# EAGLE schematic Motor_Driver2 (EAGLE 7.7.0)
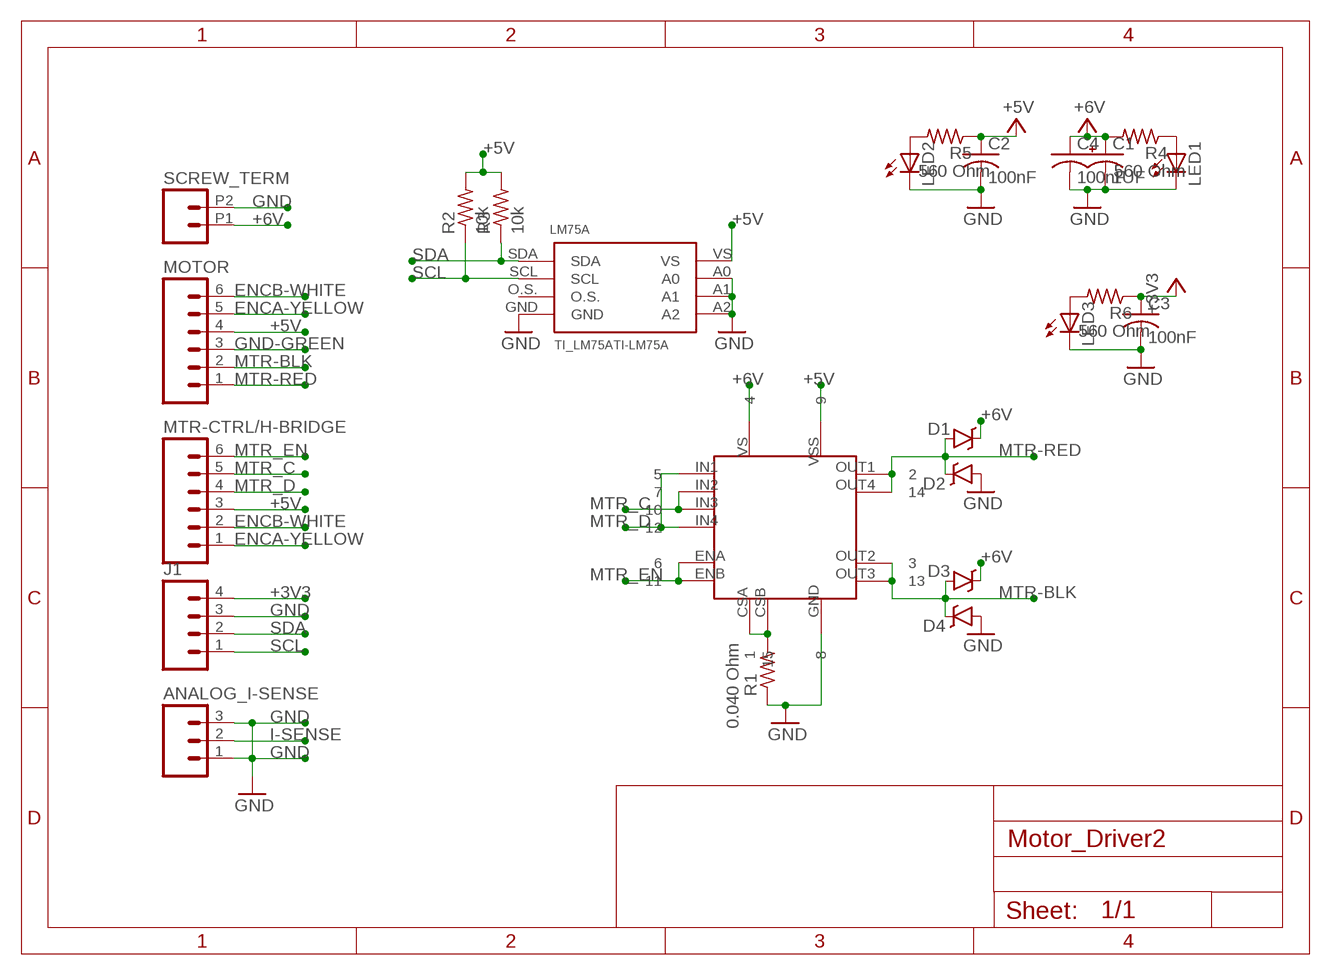
[diagram p0: schematic, sheet 1]

## Parts
ANALOG_I-SENSE  M03PTH  [1X03]
C1  1UF  1UF-50V-20%(PTH)KIT  [CPOL-RADIAL-1UF-50V-KIT]
C2  100nF  C-USC1206  [C1206]
C3  100nF  C-USC1206  [C1206]
C4  100nF  C-USC1206  [C1206]
D1  B340A  DIODE-SCHOTTKY-B340A  [SMA-DIODE]
D2  B340A  DIODE-SCHOTTKY-B340A  [SMA-DIODE]
D3  B340A  DIODE-SCHOTTKY-B340A  [SMA-DIODE]
D4  B340A  DIODE-SCHOTTKY-B340A  [SMA-DIODE]
J1  M04PTH  [1X04]
LED1  LEDSMT1206  [1206]
LED2  LEDSMT1206  [1206]
LED3  LEDSMT1206  [1206]
LM75A  TI_LM75ATI-LM75A  [TI_LM75A]
MOTOR  M06SILK_FEMALE_PTH  [1X06]
MTR-CTRL/H-BRIDGE  M06SILK_FEMALE_PTH  [1X06]
R1  0.040 Ohm  R-US_M0805  [M0805]
R2  10k  R-US_M1206  [M1206]
R3  10k  R-US_M1206  [M1206]
R4  560 Ohm  R-US_M0805  [M0805]
R5  560 Ohm  R-US_M0805  [M0805]
R6  560 Ohm  R-US_M0805  [M0805]
SCREW_TERM  M022.54MM_SCREWTERM  [1X02_2.54_SCREWTERM]
U$1  STL298N  [STL298N]

## Nets
+3V3: C3.1 J1.4 R6.1
+5V: C2.1 LM75A.VS MOTOR.4 MTR-CTRL/H-BRIDGE.3 R2.2 R3.2 R5.1
+6V: C1.1(+) C4.1 D1.C D3.C R4.2 SCREW_TERM.P1
ENCA-YELLOW: MOTOR.5 MTR-CTRL/H-BRIDGE.1
ENCB-WHITE: MOTOR.6 MTR-CTRL/H-BRIDGE.2
GND: ANALOG_I-SENSE.1 ANALOG_I-SENSE.3 C1.2(-) C2.2 C3.2 C4.2 D2.A D4.A J1.3 LED1.C LED2.C LED3.C LM75A.A0 LM75A.A1 LM75A.A2 LM75A.GND R1.1 SCREW_TERM.P2
GND-GREEN: MOTOR.3
I-SENSE: ANALOG_I-SENSE.2
MTR-BLK: D3.A D4.C MOTOR.2
MTR-RED: D1.A D2.C MOTOR.1
MTR_C: MTR-CTRL/H-BRIDGE.5
MTR_D: MTR-CTRL/H-BRIDGE.4
MTR_EN: MTR-CTRL/H-BRIDGE.6
N$1: R1.2
N$2: LED1.A R4.1
N$3: LED2.A R5.2
N$4: LED3.A R6.2
SCL: J1.1 LM75A.SCL R2.1
SDA: J1.2 LM75A.SDA R3.1
Unconnected: LM75A.O.S. U$1.CSA U$1.CSB U$1.ENA U$1.ENB U$1.GND U$1.IN1 U$1.IN2 U$1.IN3 U$1.IN4 U$1.OUT1 U$1.OUT2 U$1.OUT3 U$1.OUT4 U$1.VS U$1.VSS

## Library data of the parts
ANALOG_I-SENSE = SparkFun-Connectors:M03: Header 3 Standard 3-pin 0.1" header. Use with straight break away headers (SKU : PRT-00116), right angle break away headers (PRT-00553), swiss pins (PRT-00743), machine pins (PRT-00117), and female headers (PRT-00115). Molex polarized connector foot print use with SKU : PRT-08232 with associated crimp pins and housings.
C1 = MORE_CAPS:1UF-50V-20%(PTH): CAP ALUM 1UF 20% 50V RADIAL; PROD_ID: USR1H010MDD
C2-C4 = rcl:C-US: CAPACITOR, American symbol
D1-D4 = SparkFun-DiscreteSemi:DIODE-SCHOTTKY: Schottky diodes in SFE's production catalog BAT20J 1A 23V 0.62Vf RB751 120mA 40V 0.37Vf PMEG4005EJ 0.5A 40V 0.42Vf MBRA140 1A 40V 0.5Vf B340A 3A 40V SMA; PROD_ID: DIO-09886
J1 = SparkFun-Connectors:M04: Header 4 Standard 4-pin 0.1" header. Use with straight break away headers (SKU : PRT-00116), right angle break away headers (PRT-00553), swiss pins (PRT-00743), machine pins (PRT-00117), and female headers (PRT-00115). Molex polarized connector foot print use with SKU : PRT-08231 with associated crimp pins and housings. 1MM SMD Version SKU: PRT-10208; PROD_ID: CONN-09696
LED1-LED3 = led:LED: LED OSRAM: - CHIPLED LG R971, LG N971, LY N971, LG Q971, LY Q971, LO R971, LY R971 LH N974, LH R974 LS Q976, LO Q976, LY Q976 LO Q996 - Hyper CHIPLED LW Q18S LB Q993, LB Q99A, LB R99A - SideLED LS A670, LO A670, LY A670, LG A670, LP A670 LB A673, LV A673, LT A673, LW A673 LH A674 LY A675 LS A676, LA A676, LO A676, LY A676, LW A676 LS A679, LY A679, LG A679 - Hyper Micro SIDELED® LS Y876, LA Y876, LO Y876, LY Y876 LT Y87S - SmartLED LW L88C, LW L88S LB L89C, LB L89S, LG L890 LS L89K, LO L89K, LY L89K LS L896, LA L896, LO L896, LY L896 - TOPLED LS T670, LO T670, LY T670, LG T670, LP T670 LSG T670, LSP T670, LSY T670, LOP T670, LYG T670 LG T671, LOG T671, LSG T671 LB T673, LV T673, LT T673, LW T673 LH T674 LS T676, LA T676, LO T676, LY T676, LB T676, LH T676, LSB T676, LW T676 LB T67C, LV T67C, LT T67C, LS T67K, LO T67K, LY T67K, LW E67C LS E67B, LA E67B, LO E67B, LY E67B, LB E67C, LV E67C, LT E67C LW T67C LS T679, LY T679, LG T679 LS T770, LO T770, LY T770, LG T770, LP T770 LB T773, LV T773, LT T773, LW T773 LH T774 LS E675, LA E675, LY E675, LS T675 LS T776, LA T776, LO T776, LY T776, LB T776 LHGB T686 LT T68C, LB T68C - Hyper Mini TOPLED® LB M676 - Mini TOPLED Santana® LG M470 LS M47K, LO M47K, LY M47K Source: http://www.osram.convergy.de LUXEON: - LUMILED® LXK2-PW12-R00, LXK2-PW12-S00, LXK2-PW14-U00, LXK2-PW14-V00 LXK2-PM12-R00, LXK2-PM12-S00, LXK2-PM14-U00 LXK2-PE12-Q00, LXK2-PE12-R00, LXK2-PE12-S00, LXK2-PE14-T00, LXK2-PE14-U00 LXK2-PB12-K00, LXK2-PB12-L00, LXK2-PB12-M00, LXK2-PB14-N00, LXK2-PB14-P00, LXK2-PB14-Q00 LXK2-PR12-L00, LXK2-PR12-M00, LXK2-PR14-Q00, LXK2-PR14-R00 LXK2-PD12-Q00, LXK2-PD12-R00, LXK2-PD12-S00 LXK2-PH12-R00, LXK2-PH12-S00 LXK2-PL12-P00, LXK2-PL12-Q00, LXK2-PL12-R00 Source: www.luxeon.com KINGBRIGHT: KA-3528ASYC Source: www.kingbright.com
LM75A = TI-LM75A:TI_LM75A: 8pin SPI Flash series x25xx. Works with devices like W25X32 and BR25L32
MOTOR MTR-CTRL/H-BRIDGE = SparkFun-Connectors:M06: Header 6 Standard 6-pin 0.1" header. Use with straight break away headers (SKU : PRT-00116), right angle break away headers (PRT-00553), swiss pins (PRT-00743), machine pins (PRT-00117), and female headers (PRT-00115). Molex polarized connector foot print use with SKU : PRT-08094 with associated crimp pins and housings. NOTES ON THE VARIANTS LOCK and LOCK_LONGPADS... This footprint was designed to help hold the alignment of a through-hole component (i.e. 6-pin header) while soldering it into place. You may notice that each hole has been shifted either up or down by 0.005 of an inch from it's more standard position (which is a perfectly straight line). This slight alteration caused the pins (the squares in the middle) to touch the edges of the holes. Because they are alternating, it causes a "brace" to hold the component in place. 0.005 has proven to be the perfect amount of "off-center" position when using our standard breakaway headers. Although looks a little odd when you look at the bare footprint, once you have a header in there, the alteration is very hard to notice. Also,if you push a header all the way into place, it is covered up entirely on the bottom side. This idea of altering the position of holes to aid alignment will be further integrated into the Sparkfun Library for other footprints. It can help hold any component with 3 or more connection pins.; PROD_ID: CONN-08437
R1-R6 = rcl:R-US_: RESISTOR, American symbol
SCREW_TERM = SparkFun-Connectors:M02: Standard 2-pin 0.1" header. Use with - straight break away headers ( PRT-00116) - right angle break away headers (PRT-00553) - swiss pins (PRT-00743) - machine pins (PRT-00117) - female headers (PRT-00115) Molex polarized connector foot print use with: PRT-08233 with associated crimp pins and housings. 2.54_SCREWTERM for use with PRT-10571. 3.5mm Screw Terminal footprints for PRT-08084 5mm Screw Terminal footprints for use with PRT-08432
U$1 = ST-L298N:STL298N